# Altium schematic sheet UBX_NORA_B1_SCHEM_0005_Interface_Isolation.SchDoc
size A3; Date: 7/24/2020; CompanyName: U-blox; DrawnBy: EMOO; Engineer: EMOO; Organization: U-blox; Address1: 3950 Fairview Industrial Dr SE #100*; Address2: Salem, OR 97302; SheetNumber: 5; SheetTotal: 6; SheetSize: B; SheetTitle: Interface MCU
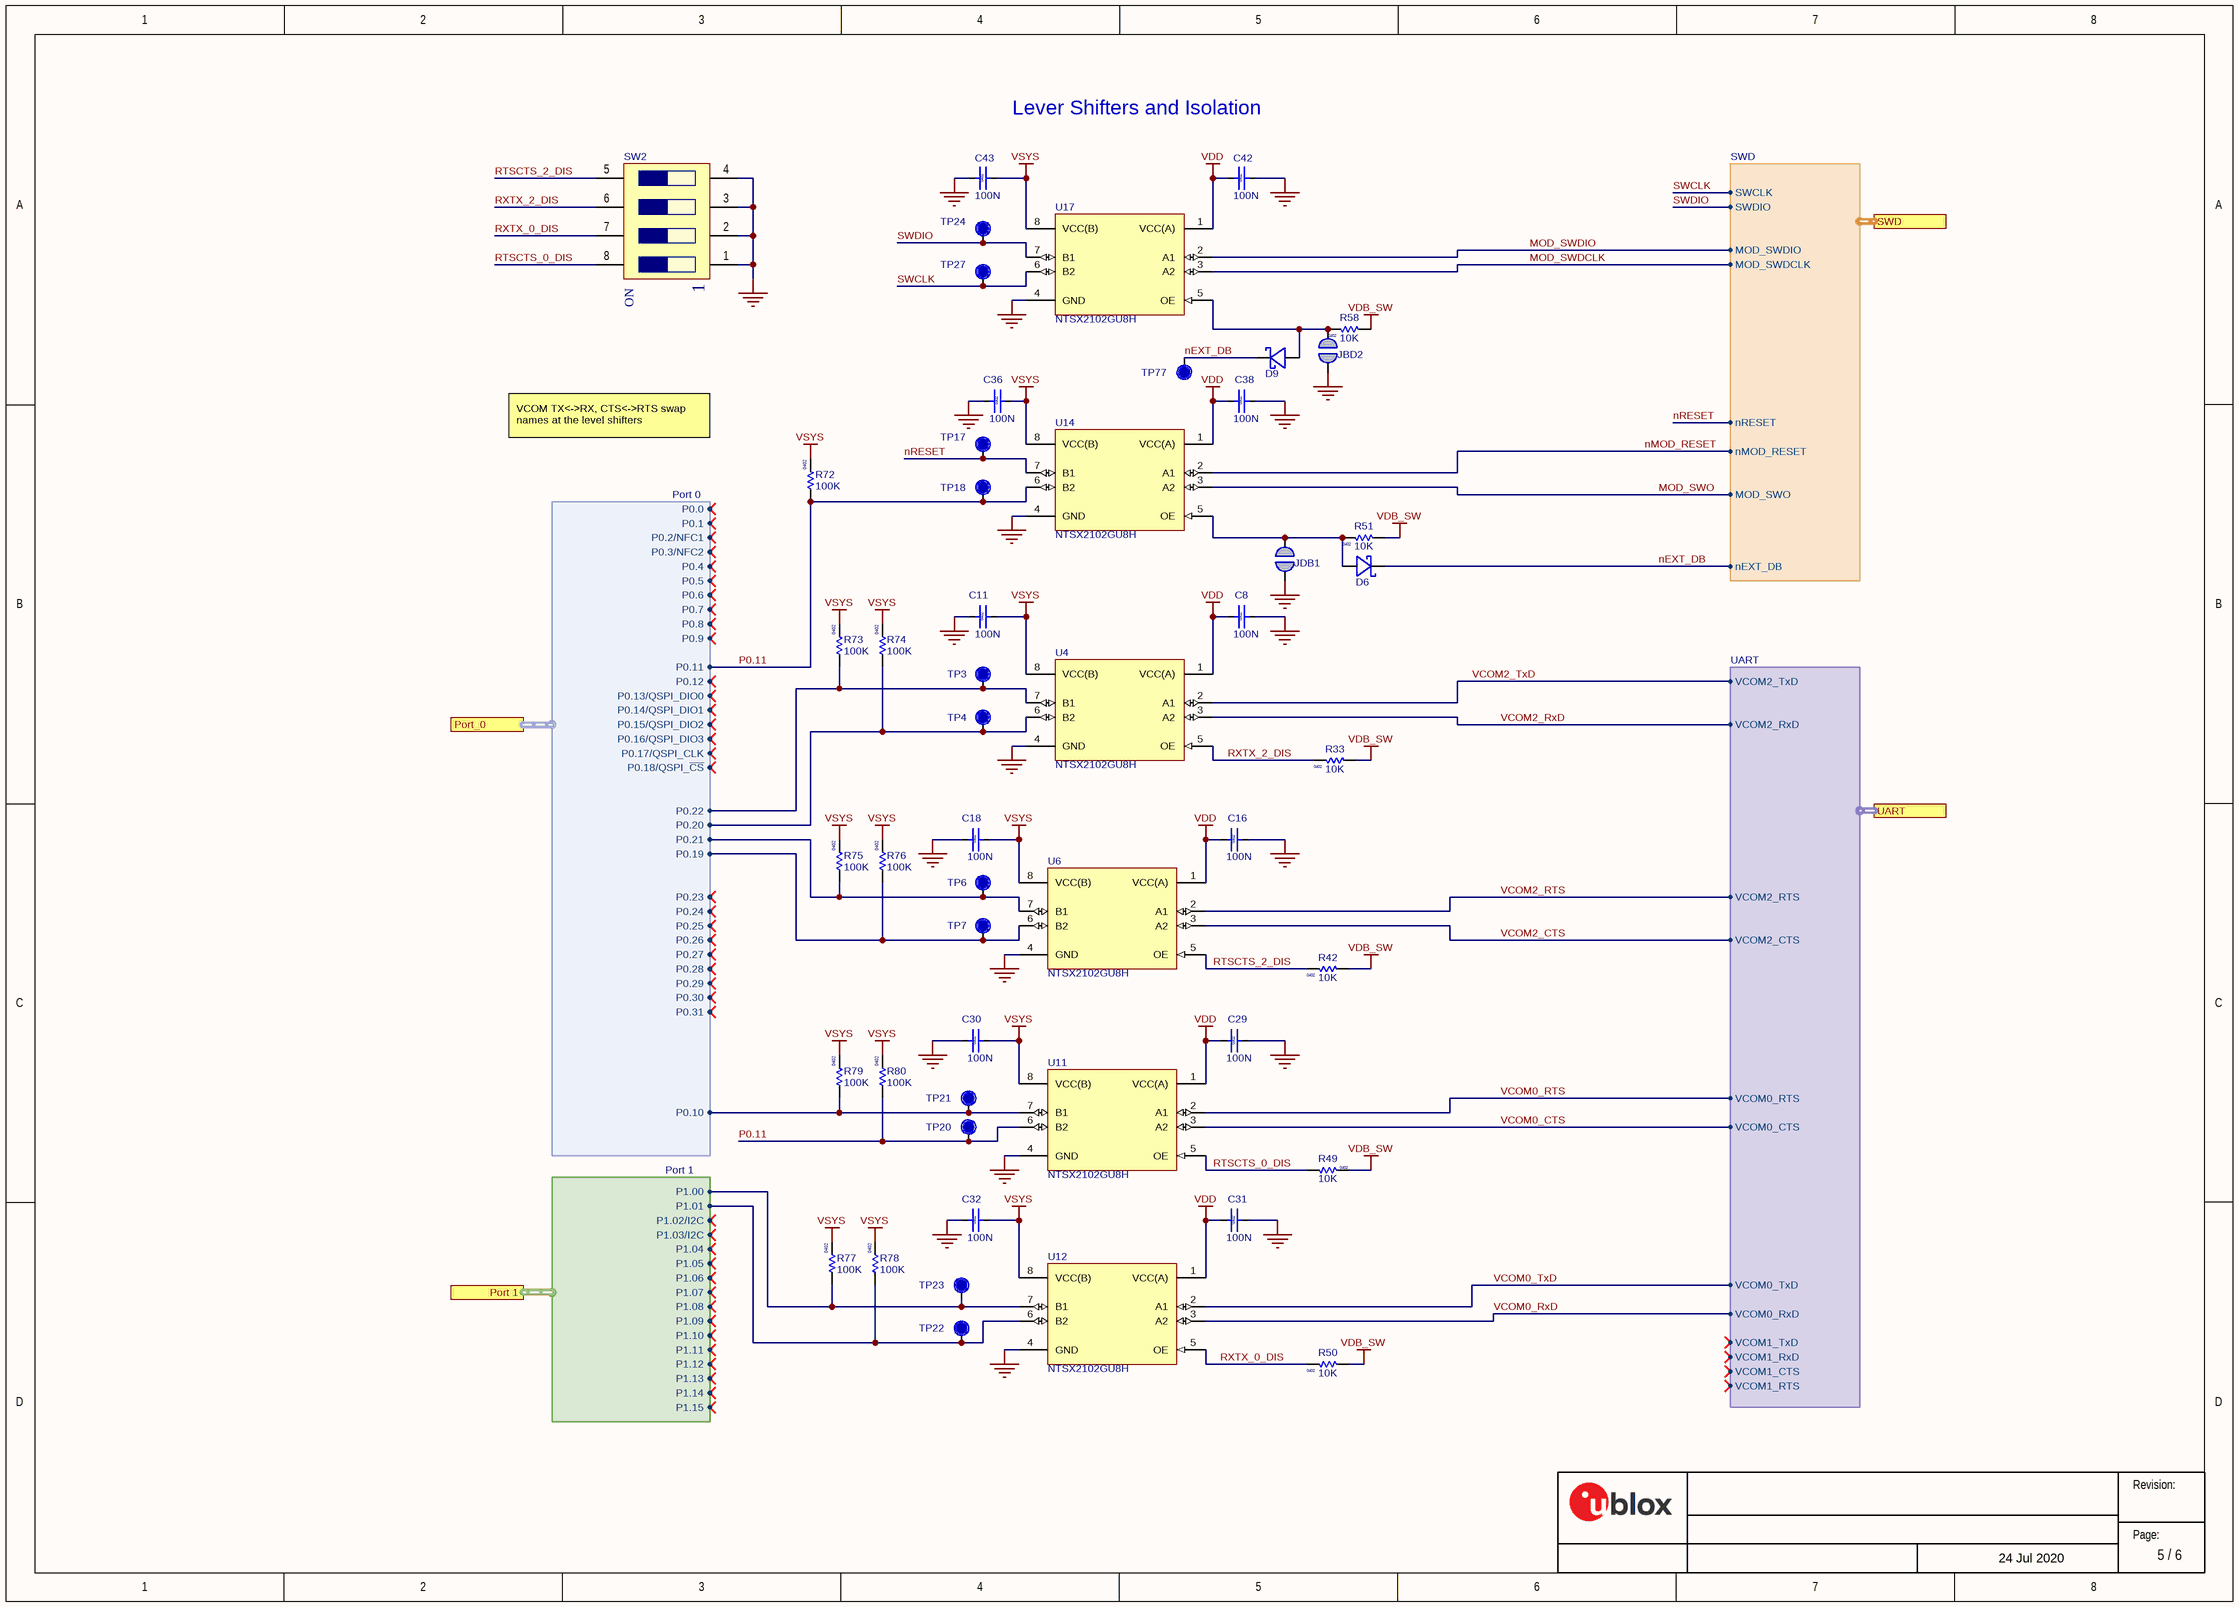
[diagram p0: UBX_NORA_B1_SCHEM_0005_Interface_Isolation.SchDoc]

## Parts
C8  value 100N  Size: 0402  [Cap 0402 HD]
C11  value 100N  Size: 0402  [Cap 0402 HD]
C16  value 100N  Size: 0402  [Cap 0402 HD]
C18  value 100N  Size: 0402  [Cap 0402 HD]
C29  value 100N  Size: 0402  [Cap 0402 HD]
C30  value 100N  Size: 0402  [Cap 0402 HD]
C31  value 100N  Size: 0402  [Cap 0402 HD]
C32  value 100N  Size: 0402  [Cap 0402 HD]
C36  value 100N  Size: 0402  [Cap 0402 HD]
C38  value 100N  Size: 0402  [Cap 0402 HD]
C42  value 100N  Size: 0402  [Cap 0402 HD]
C43  value 100N  Size: 0402  [Cap 0402 HD]
D6  (no value)  [SOD-523]
D9  (no value)  [SOD-523]
JBD2  (no value)  [Solderbridge-Open]  (no BOM)
JDB1  (no value)  [Solderbridge-Open]  (no BOM)
R33  value 10K  Size: 0402  [RES 0402 HD]
R42  value 10K  Size: 0402  [RES 0402 HD]
R49  value 10K  Size: 0402  [RES 0402 HD]
R50  value 10K  Size: 0402  [RES 0402 HD]
R51  value 10K  Size: 0402  [RES 0402 HD]
R58  value 10K  Size: 0402  [RES 0402 HD]
R72  value 100K  Size: 0402  [RES 0402 HD]
R73  value 100K  Size: 0402  [RES 0402 HD]
R74  value 100K  Size: 0402  [RES 0402 HD]
R75  value 100K  Size: 0402  [RES 0402 HD]
R76  value 100K  Size: 0402  [RES 0402 HD]
R77  value 100K  Size: 0402  [RES 0402 HD]
R78  value 100K  Size: 0402  [RES 0402 HD]
R79  value 100K  Size: 0402  [RES 0402 HD]
R80  value 100K  Size: 0402  [RES 0402 HD]
SW2  (no value)  [SOP1.27P6.2x6.2-8Pin]
TP3  TP  [TP10R]  (value not drawn)
TP4  TP  [TP10R]  (value not drawn)
TP6  TP  [TP10R]  (value not drawn)
TP7  TP  [TP10R]  (value not drawn)
TP17  TP  [TP10R]  (value not drawn)
TP18  TP  [TP10R]  (value not drawn)
TP20  TP  [TP10R]  (value not drawn)
TP21  TP  [TP10R]  (value not drawn)
TP22  TP  [TP10R]  (value not drawn)
TP23  TP  [TP10R]  (value not drawn)
TP24  TP  [TP10R]  (value not drawn)
TP27  TP  [TP10R]  (value not drawn)
TP77  TP  [TP10R]  (value not drawn)
U4  Manufacturer Part Number 1: NTSX2102GU8H  [QFN0.4P3x1-8Pin]
U6  Manufacturer Part Number 1: NTSX2102GU8H  [QFN0.4P3x1-8Pin]
U11  Manufacturer Part Number 1: NTSX2102GU8H  [QFN0.4P3x1-8Pin]
U12  Manufacturer Part Number 1: NTSX2102GU8H  [QFN0.4P3x1-8Pin]
U14  Manufacturer Part Number 1: NTSX2102GU8H  [QFN0.4P3x1-8Pin]
U17  Manufacturer Part Number 1: NTSX2102GU8H  [QFN0.4P3x1-8Pin]

## Ports
Port 1 (harness Port 1), Port_0 (harness Port 0), SWD (harness SWD), UART (harness UART)

## Harnesses
Port 0: P0.4, P0.5, P0.6, P0.7, P0.8, P0.9, P0.10, P0.11, P0.12, P0.19, P0.20, P0.21, P0.22, P0.23, P0.24, P0.25, P0.26, P0.27, P0.28, P0.29, P0.30, P0.31, P0.3/NFC2, P0.2/NFC1, P0.13/QSPI_DIO0, P0.14/QSPI_DIO1, P0.15/QSPI_DIO2, P0.16/QSPI_DIO3, P0.18/QSPI_~{CS}, P0.17/QSPI_CLK, P0.0, P0.1
UART: VCOM2_TxD, VCOM2_RxD, VCOM2_RTS, VCOM2_CTS, VCOM1_RxD, VCOM1_TxD, VCOM1_CTS, VCOM1_RTS, VCOM0_RxD, VCOM0_TxD, VCOM0_CTS, VCOM0_RTS
SWD: MOD_SWDIO, MOD_SWDCLK, SWCLK, SWDIO, nMOD_RESET, MOD_SWO, nRESET, nEXT_DB
Port 1: P1.00, P1.01, P1.02/I2C, P1.03/I2C, P1.04, P1.05, P1.06, P1.07, P1.08, P1.09, P1.10, P1.11, P1.12, P1.13, P1.14, P1.15

## Nets
GND: C8.2 C11.1 C16.2 C18.1 C29.2 C30.1 C31.2 C32.1 C36.1 C38.2 C42.2 C43.1 JBD2.1 JDB1.1 SW2.1 SW2.2 SW2.3 SW2.4 U4.4(GND) U6.4(GND) U11.4(GND) U12.4(GND) U14.4(GND) U17.4(GND)
VDB_SW: R33.1 R42.1 R49.2 R50.1 R51.1 R58.1
VDD: C8.1 C16.1 C29.1 C31.1 C38.1 C42.1 U4.1(VCC(A)) U6.1(VCC(A)) U11.1(VCC(A)) U12.1(VCC(A)) U14.1(VCC(A)) U17.1(VCC(A))
VSYS: C11.2 C18.2 C30.2 C32.2 C36.2 C43.2 R72.2 R73.2 R74.2 R75.2 R76.2 R77.2 R78.2 R79.2 R80.2 U4.8(VCC(B)) U6.8(VCC(B)) U11.8(VCC(B)) U12.8(VCC(B)) U14.8(VCC(B)) U17.8(VCC(B))
MOD_SWDCLK: U17.3(A2) ; port SWD.MOD_SWDCLK
MOD_SWDIO: U17.2(A1) ; port SWD.MOD_SWDIO
MOD_SWO: U14.3(A2) ; port SWD.MOD_SWO
nEXT_DB: D6.C(Cathode) D9.C(Cathode) TP77.1 ; port SWD.nEXT_DB
nMOD_RESET: U14.2(A1) ; port SWD.nMOD_RESET
nRESET: TP17.1 U14.7(B1) ; port SWD.nRESET
P0.11: R72.1 R80.1 TP18.1 TP20.1 U11.6(B2) U14.6(B2) ; port Port_0.P0.11
RTSCTS_0_DIS: R49.1 SW2.8 U11.5(OE)
RTSCTS_2_DIS: R42.2 SW2.5 U6.5(OE)
RXTX_0_DIS: R50.2 SW2.7 U12.5(OE)
RXTX_2_DIS: R33.2 SW2.6 U4.5(OE)
SWCLK: TP27.1 U17.6(B2) ; port SWD.SWCLK
SWDIO: TP24.1 U17.7(B1) ; port SWD.SWDIO
VCOM0_CTS: U11.3(A2) ; port UART.VCOM0_CTS
VCOM0_RTS: U11.2(A1) ; port UART.VCOM0_RTS
VCOM0_RxD: U12.3(A2) ; port UART.VCOM0_RxD
VCOM0_TxD: U12.2(A1) ; port UART.VCOM0_TxD
VCOM2_CTS: U6.3(A2) ; port UART.VCOM2_CTS
VCOM2_RTS: U6.2(A1) ; port UART.VCOM2_RTS
VCOM2_RxD: U4.3(A2) ; port UART.VCOM2_RxD
VCOM2_TxD: U4.2(A1) ; port UART.VCOM2_TxD
NetD6_A: D6.A(Anode) JDB1.2 R51.2 U14.5(OE)
NetD9_A: D9.A(Anode) JBD2.2 R58.2 U17.5(OE)
NetR73_1: R73.1 TP3.1 U4.7(B1) ; port Port_0.P0.22
NetR74_1: R74.1 TP4.1 U4.6(B2) ; port Port_0.P0.20
NetR75_1: R75.1 TP6.1 U6.7(B1) ; port Port_0.P0.21
NetR76_1: R76.1 TP7.1 U6.6(B2) ; port Port_0.P0.19
NetR77_1: R77.1 TP23.1 U12.7(B1) ; port Port 1.P1.00
NetR78_1: R78.1 TP22.1 U12.6(B2) ; port Port 1.P1.01
NetR79_1: R79.1 TP21.1 U11.7(B1) ; port Port_0.P0.10

## Notes on the sheet
- Lever Shifters and Isolation
- VCOM TX<->RX, CTS<->RTS swap names at the level shifters
- 24 Jul 2020
- Revision:
- Page:
- (in symbol UBXH19-0000055) ON

## Library data of the parts
C8 C11 C16 C18 C29-C32 C36 C38 C42 C43 = UBXH01-2021002: CAP CER X5R 0402 100N 10% 10V; Manufacturer: Murata Manufacturing Company, Ltd.; Manufacturer P/N: GRM155R61A104KA01; Editor: roland.rust; Env: GREEN; Permitted Use: Volume Products; Perferred: PREF; Mfg P/N Status: NRND; Mfg P/N Split: 100; Mfg P/N Released: Yes; Part Number: UBXH01-2021002; Tolerance: 10%; Max Voltage: 10V; Part Type: Capacitor; Released by: roland.rust; Release Data: 2005-07-22T13:59:44; UBX Wiki: https://wiki.u-blox.com/bin/view/Operations/PartDetails?index=5759; RefDes: C; Manufacturer 2: Samsung Electro-Mechanics; Manufacturer P/N 2: CL05A104KP5NNN; Mfg P/N Status 2: Active; Mfg P/N Split 2: 0; Mfg P/N Released 2: Yes; Mfg P/N Datasheet 2: https://wiki.u-blox.com/bin/view/Generic/Docs/DocumentSummary?index=28113
D6 D9 = UBXH07-0000039: SCHOTTKY BARRIER DIODE 30V 200mA; Manufacturer: ON Semiconductor; Value: RB521S30T1G; Editor: matej.budin; Released by: pierpaolo.arban; Env: ROHS; Permitted Use: Volume Products; Perferred: PREF; Mfg P/N Status: Active; Mfg P/N Split: 100; Mfg P/N Released: Yes; Part Number: UBXH07-0000039; Max Voltage: 30V; Max Current: 200mA; Part Type: Diode; Release Data: 2015-06-18T10:04:48; UBX Wiki: https://wiki.u-blox.com/bin/view/Operations/PartDetails?index=22753; RefDes: D; Manufacturer P/N: RB521S30T1G; Mfg P/N Datasheet: https://wiki.u-blox.com/bin/view/Generic/Docs/DocumentSummary?index=22755
JBD2 JDB1 = UBXH00-0000082: SOLDERBRIDGE-OPEN; Editor: aneeb.sohail; Env: GREEN; Permitted Use: Volume Products; Perferred: PREF; Part Number: UBXH00-0000082; Min Operating Temp: -55°C; Max Operating Temp: 155°C; Part Type: Connector; UBX Wiki: https://wiki.u-blox.com/bin/view/Operations/PartDetails?index=36361; RefDes: J
R33 R42 R49-R51 R58 = UBXH18-0000065: RES THICK FILM CHIP 0402 10K 1% 63mW; Manufacturer: KOA; Manufacturer P/N: RK73H1ETTP1002F; Editor: erian.bezhani; Released by: massimo.vlacci; Env: ROHS; Permitted Use: Volume Products; Perferred: PREF; Mfg P/N Status: Active; Mfg P/N Split: 100; Mfg P/N Released: Yes; Part Number: UBXH18-0000065; Tolerance: 1%; Max Power: 63mW; Part Type: Resistor; Release Data: 2012-06-08T18:02:21; UBX Wiki: https://wiki.u-blox.com/bin/view/Operations/PartDetails?index=16837; RefDes: R; Mfg P/N Datasheet: https://wiki.u-blox.com/bin/view/Generic/Docs/DocumentSummary?index=8222
R72-R80 = UBXH18-0000005: RES THICK FILM CHIP 0402 100K 1% 63mW; Manufacturer: KOA; Manufacturer P/N: RK73H1ETTP1003F; Editor: dario.antonaz; Released by: sandro.sestan; Env: ROHS; Permitted Use: Volume Products; Mfg P/N Status: Active; Mfg P/N Split: 100; Mfg P/N Released: Yes; Part Number: UBXH18-0000005; Tolerance: 1%; Max Power: 63mW; Part Type: Resistor; Release Data: 2009-11-30T11:05:22; UBX Wiki: https://wiki.u-blox.com/bin/view/Operations/PartDetails?index=8114; Perferred: N/A; RefDes: R; Mfg P/N Datasheet: https://wiki.u-blox.com/bin/view/Generic/Docs/DocumentSummary?index=8222; Manufacturer 2: ROHM; Manufacturer P/N 2: MCR01MZPF1003; Mfg P/N Status 2: Active; Mfg P/N Split 2: 0; Mfg P/N Released 2: Yes; Mfg P/N Datasheet 2: https://wiki.u-blox.com/bin/view/Generic/Docs/DocumentSummary?index=8186
SW2 = UBXH19-0000055: DIP SWITCH QUAD SPST SLIDE SMT 24V 25mA; Editor: eric.moog; Env: ROHS; Permitted Use: Support Products; Perferred: PREF; Manufacturer P/N: *; Part Number: UBXH19-0000055; Max Voltage: 24V; Max Current: 25mA; Min Operating Temp: -40°C; Max Operating Temp: 85°C; Part Type: Switch; UBX Wiki: https://wiki.u-blox.com/bin/view/Operations/PartDetails?index=38926; RefDes: S
TP3 TP4 TP6 TP7 TP17 TP18 TP20-TP24 TP27 TP77 = UBXH00-0000096: TESTPOINT 1MM CIRCULAR; Editor: eric.moog; Permitted Use: Volume Products; Perferred: PREF; Part Number: UBXH00-0000096; Min Operating Temp: -55°C; Max Operating Temp: 125°C; Part Type: Testpoint; UBX Wiki: https://wiki.u-blox.com/bin/view/Operations/PartDetails?index=38784; Env: N/A; RefDes: TP
U4 U6 U11 U12 U14 U17 = UBXH10-0000106: 2-BIT BIDIRECTIONAL TRANSLATING TRANSCEIVER AUTO DIRECTION SENSING OPEN DRAIN XQFN8 5.5V; Part Name: IC TXRX TRANSLATING 8XQFN; Part_Type: Digital Logic; Manufacturer 1: NXP Semiconductors; Manufacturer: NXP; Body Size: 1.4mm X 1.2mm; Component Mounting Type: SMT; Logic Type: Level Translator; MFG Package: XFQFN-8; Number of Circuits: 1; SMT Pitch: 0.4mm; Use in new designs: Yes; Value: NTSX2102GU8; Editor: eric.moog; Env: ROHS; Permitted Use: Volume Products; Perferred: PREF; Mfg P/N Status: Active; Mfg P/N Split: 100; Mfg P/N Released: No; Part Number: UBXH10-0000106; Height: 0.5mm; Package Type: QFN; Pins: 8; Voltage: 5.5V; Max Voltage: 5.5V; Min Operating Temp: -40°C; Max Operating Temp: 85°C; Part Type: Interface; UBX Wiki: https://wiki.u-blox.com/bin/view/Operations/PartDetails?index=38826; RefDes: U; Manufacturer P/N: NTSX2102GU8; Mfg P/N Datasheet: https://wiki.u-blox.com/bin/view/Generic/Docs/DocumentSummary?index=38756